# Altium schematic sheet Hierarchical schematics design.SchDoc: Hierarchical schematics design
size A4; Revision: 1; SheetNumber: 1; SheetTotal: 31
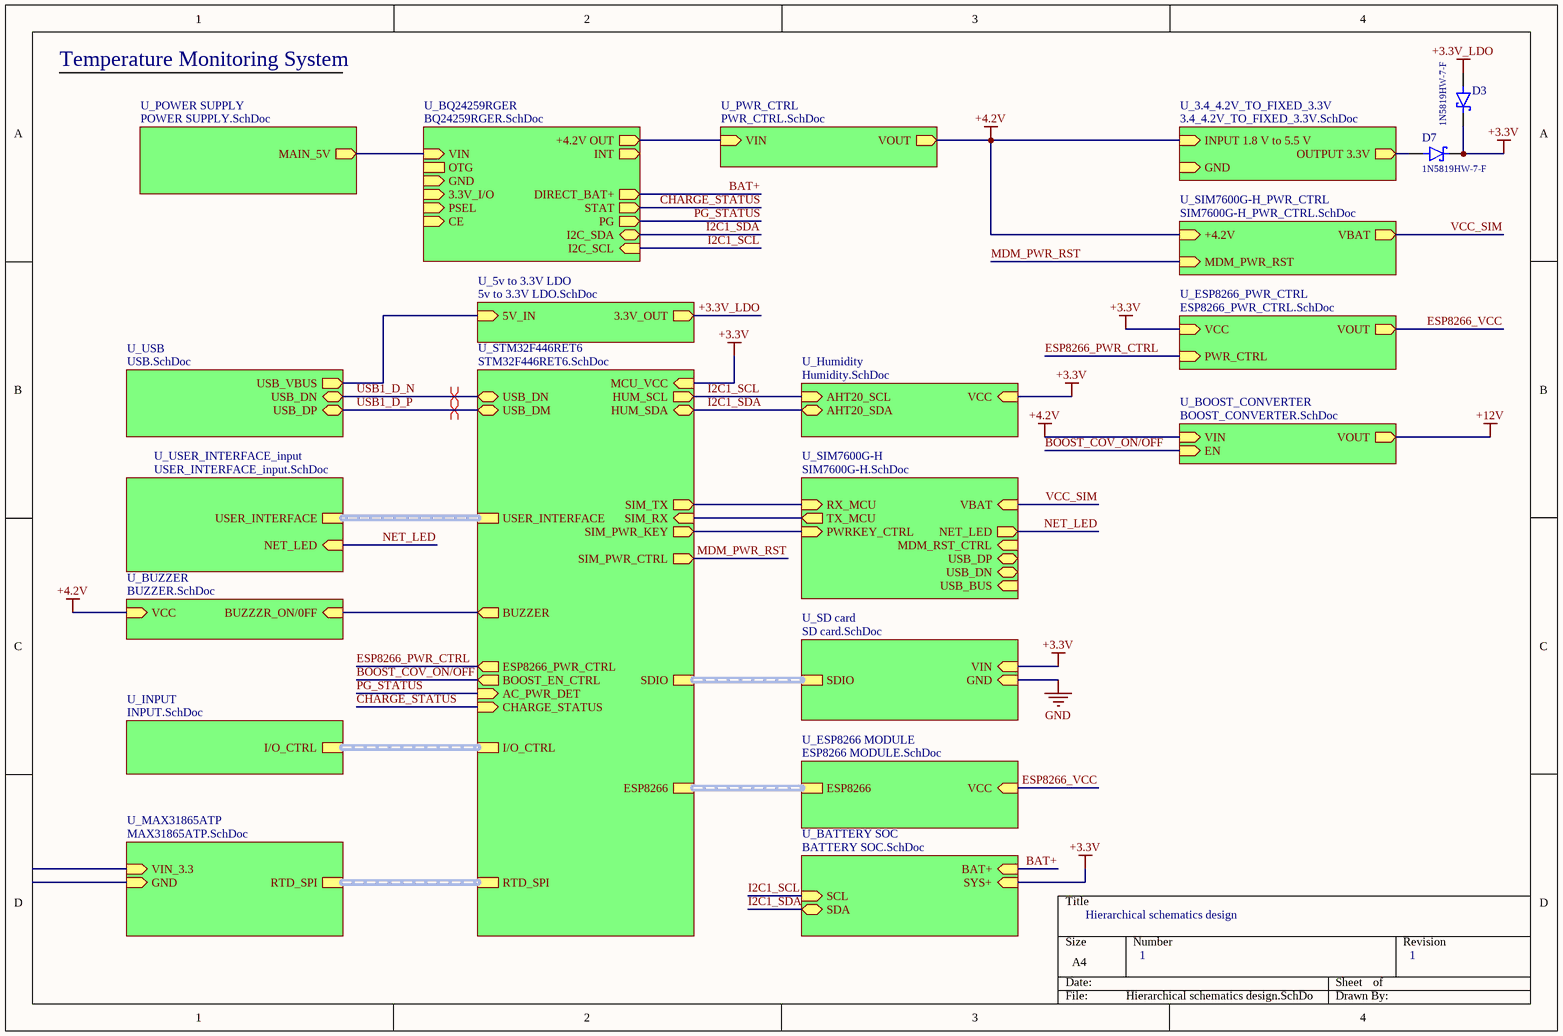
[diagram p0: Hierarchical schematics design.SchDoc]

## Parts
D3  1N5819HW-7-F  [SOD3715X145N]
D7  1N5819HW-7-F  [SOD3715X145N]

## Sub-sheets
U_3.4_4.2V_TO_FIXED_3.3V = 3.4_4.2V_TO_FIXED_3.3V.SchDoc: INPUT 1.8 V to 5.5 V (in), OUTPUT 3.3V (out), GND (in)
U_5v to 3.3V LDO = 5v to 3.3V LDO.SchDoc: 5V_IN (in), 3.3V_OUT (out)
U_BATTERY SOC = BATTERY SOC.SchDoc: BAT+ (in), SYS+ (in), SCL (in), SDA (bidir)
U_BOOST_CONVERTER = BOOST_CONVERTER.SchDoc: VIN (in), EN (in), VOUT (out)
U_BQ24259RGER = BQ24259RGER.SchDoc: +4.2V OUT (out), I2C_SCL (in), I2C_SDA (bidir), INT (out), OTG, CE (in), GND (in), 3.3V_I/O (in), VIN (in), PSEL (in), STAT (out), PG (out), DIRECT_BAT+ (out)
U_BUZZER = BUZZER.SchDoc: BUZZZR_ON/0FF (in), VCC (in)
U_ESP8266 MODULE = ESP8266 MODULE.SchDoc: ESP8266 (harness ESP8266), VCC (in)
U_ESP8266_PWR_CTRL = ESP8266_PWR_CTRL.SchDoc: PWR_CTRL (in), VCC (in), VOUT (out)
U_Humidity = Humidity.SchDoc: AHT20_SCL (in), AHT20_SDA (bidir), VCC (in)
U_INPUT = INPUT.SchDoc: I/O_CTRL (harness I/O)
U_MAX31865ATP = MAX31865ATP.SchDoc: RTD_SPI (harness RTD_SENSOR), VIN_3.3 (in), GND (in)
U_POWER SUPPLY = POWER SUPPLY.SchDoc: MAIN_5V (out)
U_PWR_CTRL = PWR_CTRL.SchDoc: VIN (in), VOUT (out)
U_SD card = SD card.SchDoc: SDIO (harness SD_CARD), VIN (in), GND (in)
U_SIM7600G-H = SIM7600G-H.SchDoc: TX_MCU (out), RX_MCU (in), USB_BUS (in), USB_DP (bidir), USB_DN (bidir), VBAT (in), PWRKEY_CTRL (in), MDM_RST_CTRL (in), NET_LED (out)
U_SIM7600G-H_PWR_CTRL = SIM7600G-H_PWR_CTRL.SchDoc: MDM_PWR_RST (in), +4.2V (in), VBAT (out)
U_STM32F446RET6 = STM32F446RET6.SchDoc: RTD_SPI (harness RTD_SENSOR), SDIO (harness SD_CARD), ESP8266 (harness ESP8266), SIM_TX (out), SIM_RX (in), SIM_PWR_KEY (out), HUM_SCL (out), HUM_SDA (bidir), USB_DN (bidir), USB_DM (bidir), USER_INTERFACE (harness *), MCU_VCC (in), ESP8266_PWR_CTRL (out), BUZZER (out), I/O_CTRL (harness I/O), AC_PWR_DET (in), CHARGE_STATUS (in), SIM_PWR_CTRL (out), BOOST_EN_CTRL (out)
U_USB = USB.SchDoc: USB_VBUS (out), USB_DN (bidir), USB_DP (bidir)
U_USER_INTERFACE_input = USER_INTERFACE_input.SchDoc: USER_INTERFACE (harness *), NET_LED (in)

## Nets
+3.3V: D3.C(K) D7.C(K) ; sheet U_SD card/VIN, sheet U_STM32F446RET6/MCU_VCC, sheet U_Humidity/VCC, sheet U_BATTERY SOC/SYS+, sheet U_ESP8266_PWR_CTRL/VCC
+3.3V_LDO: D3.A ; sheet U_5v to 3.3V LDO/3.3V_OUT
+4.2V: sheet U_PWR_CTRL/VOUT, sheet U_3.4_4.2V_TO_FIXED_3.3V/INPUT 1.8 V to 5.5 V, sheet U_BUZZER/VCC, sheet U_SIM7600G-H_PWR_CTRL/+4.2V, sheet U_BOOST_CONVERTER/VIN
+12V: sheet U_BOOST_CONVERTER/VOUT
GND: sheet U_SD card/GND
BAT+: sheet U_BQ24259RGER/DIRECT_BAT+, sheet U_BATTERY SOC/BAT+
BOOST_COV_ON/OFF: sheet U_STM32F446RET6/BOOST_EN_CTRL, sheet U_BOOST_CONVERTER/EN
CHARGE_STATUS: sheet U_BQ24259RGER/STAT, sheet U_STM32F446RET6/CHARGE_STATUS
ESP8266_PWR_CTRL: sheet U_STM32F446RET6/ESP8266_PWR_CTRL, sheet U_ESP8266_PWR_CTRL/PWR_CTRL
ESP8266_VCC: sheet U_ESP8266 MODULE/VCC, sheet U_ESP8266_PWR_CTRL/VOUT
I2C1_SCL: sheet U_BQ24259RGER/I2C_SCL, sheet U_STM32F446RET6/HUM_SCL, sheet U_Humidity/AHT20_SCL, sheet U_BATTERY SOC/SCL
I2C1_SDA: sheet U_BQ24259RGER/I2C_SDA, sheet U_STM32F446RET6/HUM_SDA, sheet U_Humidity/AHT20_SDA, sheet U_BATTERY SOC/SDA
MDM_PWR_RST: sheet U_STM32F446RET6/SIM_PWR_CTRL, sheet U_SIM7600G-H_PWR_CTRL/MDM_PWR_RST
NET_LED: sheet U_SIM7600G-H/NET_LED, sheet U_USER_INTERFACE_input/NET_LED
PG_STATUS: sheet U_BQ24259RGER/PG, sheet U_STM32F446RET6/AC_PWR_DET
USB1_D_N: sheet U_STM32F446RET6/USB_DN, sheet U_USB/USB_DN
USB1_D_P: sheet U_STM32F446RET6/USB_DM, sheet U_USB/USB_DP
VCC_SIM: sheet U_SIM7600G-H/VBAT, sheet U_SIM7600G-H_PWR_CTRL/VBAT
NetD7_A: D7.A ; sheet U_3.4_4.2V_TO_FIXED_3.3V/OUTPUT 3.3V
(unnamed): sheet U_PWR_CTRL/VIN, sheet U_BQ24259RGER/+4.2V OUT
(unnamed): sheet U_BQ24259RGER/VIN, sheet U_POWER SUPPLY/MAIN_5V
(unnamed): sheet U_STM32F446RET6/SIM_TX, sheet U_SIM7600G-H/RX_MCU
(unnamed): sheet U_STM32F446RET6/SIM_RX, sheet U_SIM7600G-H/TX_MCU
(unnamed): sheet U_STM32F446RET6/SIM_PWR_KEY, sheet U_SIM7600G-H/PWRKEY_CTRL
(unnamed): sheet U_STM32F446RET6/BUZZER, sheet U_BUZZER/BUZZZR_ON/0FF
(unnamed): sheet U_USB/USB_VBUS, sheet U_5v to 3.3V LDO/5V_IN

## Buses and harness runs
harness sheet U_ESP8266 MODULE/ESP8266 = sheet U_STM32F446RET6/ESP8266
harness sheet U_INPUT/I/O_CTRL = sheet U_STM32F446RET6/I/O_CTRL
harness sheet U_MAX31865ATP/RTD_SPI = sheet U_STM32F446RET6/RTD_SPI
harness sheet U_SD card/SDIO = sheet U_STM32F446RET6/SDIO
harness sheet U_STM32F446RET6/USER_INTERFACE = sheet U_USER_INTERFACE_input/USER_INTERFACE

## Layout directives
differential pair; net class USB: USB1_D_N, USB1_D_P

## Notes on the sheet
- Temperature Monitoring System

## Library data of the parts
D3 D7 = 1N5819HW-7-F: Diode Schottky 40 V 1A Surface Mount SOD-123; MF: Diodes Inc.; Value: *; SnapEDA_Link: https://www.snapeda.com/parts/1N5819HW-7-F/Diodes+Inc./view-part/?ref=snap; Purchase-URL: https://pricing.snapeda.com/search/part/1N5819HW-7-F/?ref=eda; Availability: In Stock; Price: None; Package: SOD-123 Fairchild Semiconductor; Check_prices: https://www.snapeda.com/parts/1N5819HW-7-F/Diodes+Inc./view-part/?ref=eda; MP: 1N5819HW-7-F